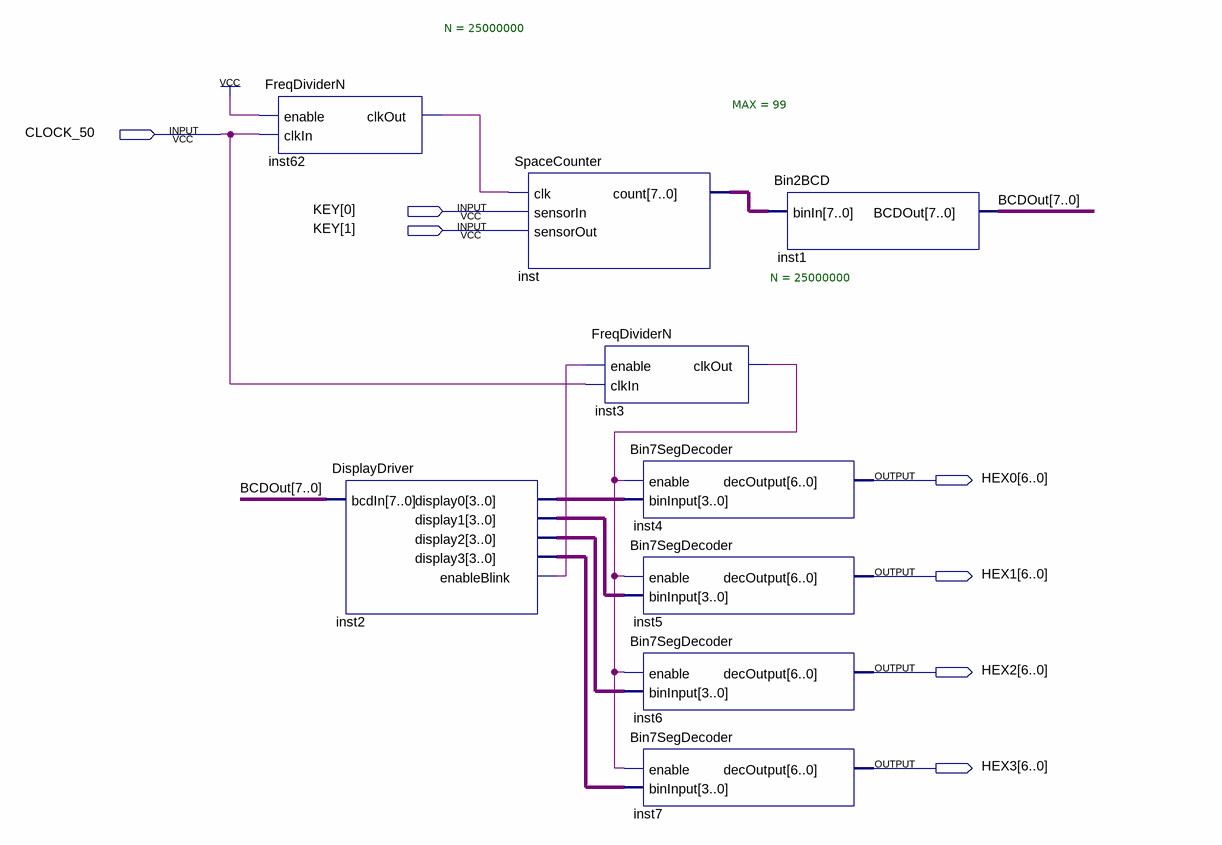
[diagram p0: schematic sheet]
// Quartus schematic ParkDisplay_Demo.bdf as structural Verilog: 9 symbols, 7 pins
module ParkDisplay_Demo (
  input  CLOCK_50,
  input  [1:0] KEY,
  output [6:0] HEX0,
  output [6:0] HEX1,
  output [6:0] HEX2,
  output [6:0] HEX3
);

  wire inst2_enableblink, inst3_clkout, inst62_clkout;
  wire [3:0] inst2_display0, inst2_display1, inst2_display2, inst2_display3;
  wire [7:0] BCDOut, inst_count;

  FreqDividerN #(.N(25000000)) inst62 (.enable(1'b1), .clkIn(CLOCK_50), .clkOut(inst62_clkout));
  DisplayDriver inst2 (
    .bcdIn(BCDOut), .display0(inst2_display0), .display1(inst2_display1), .display2(inst2_display2),
    .display3(inst2_display3), .enableBlink(inst2_enableblink));
  SpaceCounter #(.MAX(99)) inst (.clk(inst62_clkout), .sensorIn(KEY[0]), .sensorOut(KEY[1]), .count(inst_count));
  FreqDividerN #(.N(25000000)) inst3 (.enable(inst2_enableblink), .clkIn(CLOCK_50), .clkOut(inst3_clkout));
  Bin7SegDecoder inst4 (.enable(inst3_clkout), .binInput(inst2_display0), .decOutput(HEX0));
  Bin7SegDecoder inst5 (.enable(inst3_clkout), .binInput(inst2_display1), .decOutput(HEX1));
  Bin7SegDecoder inst6 (.enable(inst3_clkout), .binInput(inst2_display2), .decOutput(HEX2));
  Bin7SegDecoder inst7 (.enable(inst3_clkout), .binInput(inst2_display3), .decOutput(HEX3));
  Bin2BCD inst1 (.binIn(inst_count), .BCDOut(BCDOut));
endmodule
